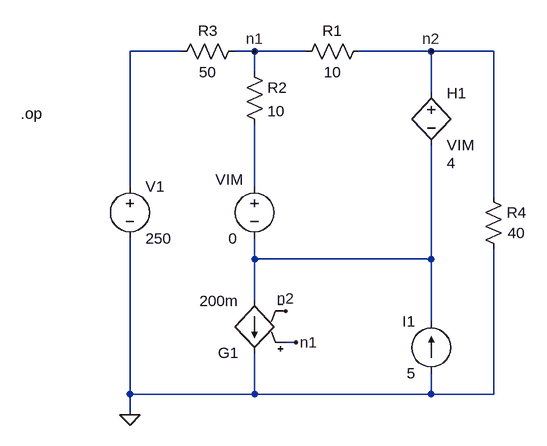
[diagram p0: schematic example3_v2.asc]
example3_v2.asc, the LTspice schematic file:
Version 4
SHEET 1 880 680
WIRE -32 80 -112 80
WIRE 80 80 48 80
WIRE 160 80 80 80
WIRE 352 80 240 80
WIRE 448 80 352 80
WIRE 80 112 80 80
WIRE 352 144 352 80
WIRE -112 288 -112 80
WIRE 80 288 80 192
WIRE 448 304 448 80
WIRE 80 400 80 368
WIRE 352 400 352 224
WIRE 352 400 80 400
WIRE 80 464 80 400
WIRE 352 496 352 400
WIRE 144 528 128 528
WIRE -112 608 -112 368
WIRE 80 608 80 544
WIRE 80 608 -112 608
WIRE 352 608 352 576
WIRE 352 608 80 608
WIRE 448 608 448 384
WIRE 448 608 352 608
WIRE -112 640 -112 608
FLAG -112 640 0
FLAG 80 80 n1
FLAG 352 80 n2
FLAG 144 528 n1
FLAG 128 480 n2
SYMBOL res 256 64 R90
WINDOW 0 0 56 VBottom 2
WINDOW 3 32 56 VTop 2
SYMATTR InstName R1
SYMATTR Value 10
SYMBOL g 80 560 R180
SYMATTR InstName G1
SYMATTR Value 200m
SYMBOL voltage -112 272 R0
WINDOW 123 0 0 Left 0
WINDOW 39 0 0 Left 0
SYMATTR InstName V1
SYMATTR Value 250
SYMBOL res 64 96 R0
SYMATTR InstName R2
SYMATTR Value 10
SYMBOL res 64 64 R90
WINDOW 0 0 56 VBottom 2
WINDOW 3 32 56 VTop 2
SYMATTR InstName R3
SYMATTR Value 50
SYMBOL res 432 288 R0
WINDOW 3 38 72 Left 2
SYMATTR InstName R4
SYMATTR Value 40
SYMBOL current 352 576 R180
WINDOW 0 24 80 Left 2
WINDOW 3 24 0 Left 2
SYMATTR InstName I1
SYMATTR Value 5
SYMBOL h 352 128 R0
WINDOW 123 24 124 Left 2
SYMATTR InstName H1
SYMATTR Value VIM
SYMATTR Value2 4
SYMBOL voltage 80 272 R0
WINDOW 0 -60 5 Left 2
WINDOW 3 -40 96 Left 2
WINDOW 123 0 0 Left 0
WINDOW 39 0 0 Left 0
SYMATTR InstName VIM
SYMATTR Value 0
TEXT -280 176 Left 2 !.op

The netlist it stands for:
* example3_v2.asc
R1 n2 n1 10
G1 N003 0 n1 n2 200m
V1 N001 0 250
R2 n1 N002 10
R3 n1 N001 50
R4 n2 0 40
I1 0 N003 5
H1 n2 N003 VIM 4
VIM N002 N003 0
.op
.backanno
.end